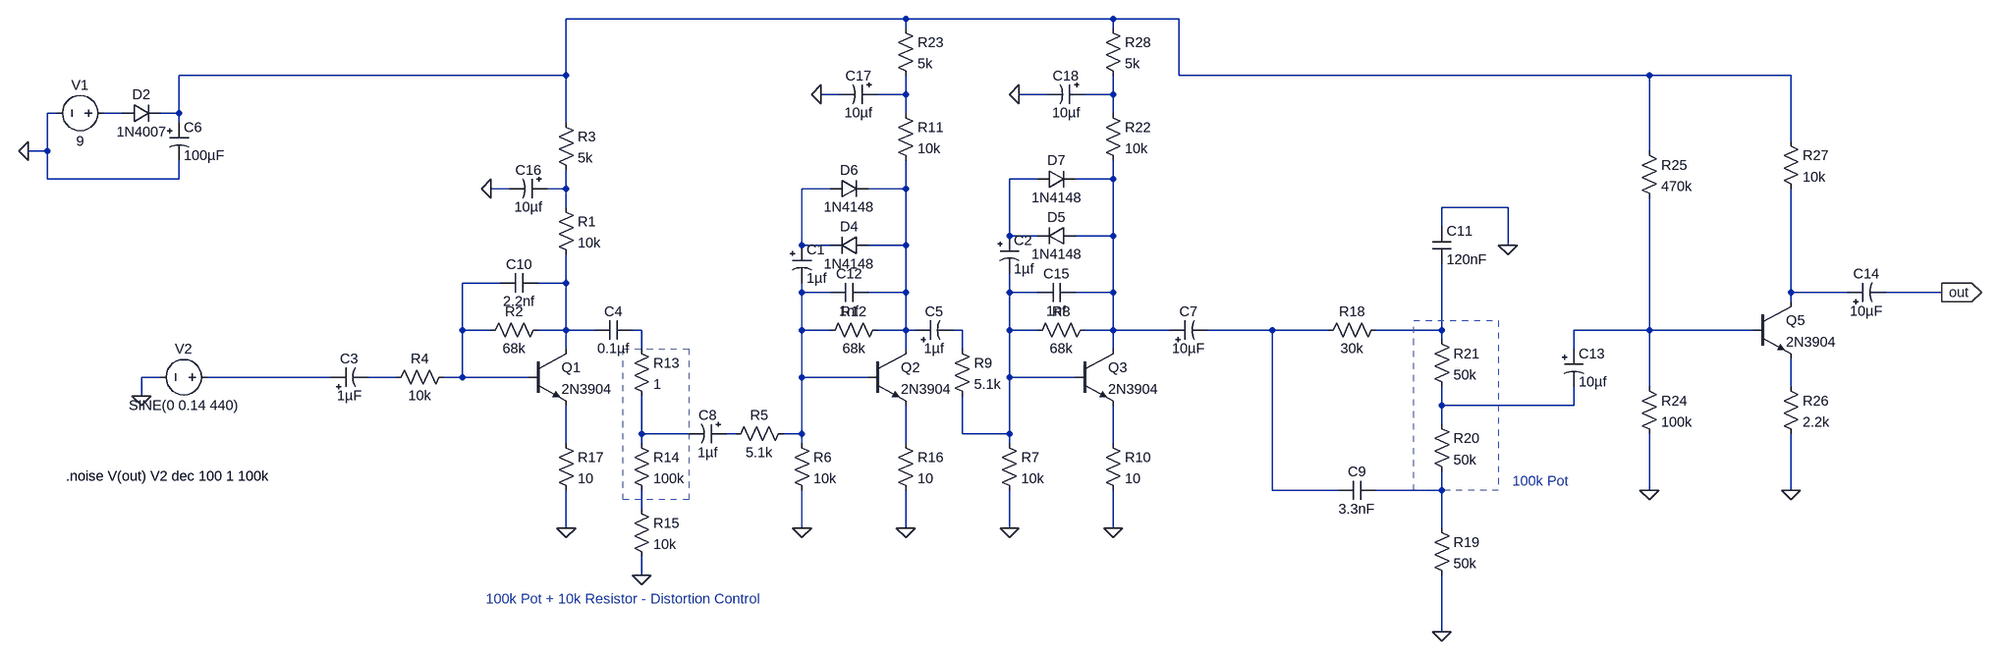
[diagram p0: schematic trantest_6_1.asc]
trantest_6_1.asc, the LTspice schematic file:
Version 4
SHEET 1 3536 1060
WIRE 1456 -432 880 -432
WIRE 1808 -432 1456 -432
WIRE 1920 -432 1808 -432
WIRE 1456 -416 1456 -432
WIRE 1808 -416 1808 -432
WIRE 880 -336 880 -432
WIRE 880 -336 -240 -336
WIRE 1920 -336 1920 -432
WIRE 2896 -336 1920 -336
WIRE 3168 -336 2896 -336
WIRE 1344 -304 1312 -304
WIRE 1456 -304 1456 -336
WIRE 1456 -304 1408 -304
WIRE 1696 -304 1648 -304
WIRE 1808 -304 1808 -336
WIRE 1808 -304 1760 -304
WIRE -448 -272 -464 -272
WIRE -336 -272 -368 -272
WIRE -240 -272 -240 -336
WIRE -240 -272 -272 -272
WIRE 1456 -272 1456 -304
WIRE 1808 -272 1808 -304
WIRE -240 -256 -240 -272
WIRE 880 -256 880 -336
WIRE 3168 -224 3168 -336
WIRE -464 -208 -464 -272
WIRE -464 -208 -496 -208
WIRE 2896 -208 2896 -336
WIRE -464 -160 -464 -208
WIRE -240 -160 -240 -192
WIRE -240 -160 -464 -160
WIRE 1680 -160 1632 -160
WIRE 1808 -160 1808 -192
WIRE 1808 -160 1744 -160
WIRE 784 -144 752 -144
WIRE 880 -144 880 -176
WIRE 880 -144 848 -144
WIRE 1328 -144 1280 -144
WIRE 1456 -144 1456 -192
WIRE 1456 -144 1392 -144
WIRE 880 -112 880 -144
WIRE 2656 -112 2544 -112
WIRE 2544 -80 2544 -112
WIRE 1632 -64 1632 -160
WIRE 1680 -64 1632 -64
WIRE 1808 -64 1808 -160
WIRE 1808 -64 1744 -64
WIRE 1280 -48 1280 -144
WIRE 1328 -48 1280 -48
WIRE 1456 -48 1456 -144
WIRE 1456 -48 1392 -48
WIRE 2656 -48 2656 -112
WIRE 768 16 704 16
WIRE 880 16 880 -32
WIRE 880 16 832 16
WIRE 1280 32 1280 16
WIRE 1328 32 1280 32
WIRE 1456 32 1456 -48
WIRE 1456 32 1392 32
WIRE 1632 32 1632 0
WIRE 1680 32 1632 32
WIRE 1808 32 1808 -64
WIRE 1808 32 1744 32
WIRE 3168 32 3168 -144
WIRE 3264 32 3168 32
WIRE 3424 32 3328 32
WIRE 3168 48 3168 32
WIRE 704 96 704 16
WIRE 752 96 704 96
WIRE 880 96 880 16
WIRE 880 96 832 96
WIRE 928 96 880 96
WIRE 1008 96 992 96
WIRE 1280 96 1280 32
WIRE 1328 96 1280 96
WIRE 1456 96 1456 32
WIRE 1456 96 1408 96
WIRE 1472 96 1456 96
WIRE 1552 96 1536 96
WIRE 1632 96 1632 32
WIRE 1680 96 1632 96
WIRE 1808 96 1808 32
WIRE 1808 96 1760 96
WIRE 1904 96 1808 96
WIRE 2256 96 1968 96
WIRE 2352 96 2256 96
WIRE 2544 96 2544 -16
WIRE 2544 96 2432 96
WIRE 2896 96 2896 -128
WIRE 2896 96 2768 96
WIRE 3104 96 2896 96
WIRE 2544 112 2544 96
WIRE 880 128 880 96
WIRE 1008 128 1008 96
WIRE 1456 128 1456 96
WIRE 1552 128 1552 96
WIRE 1808 128 1808 96
WIRE 2768 128 2768 96
WIRE -272 176 -304 176
WIRE 480 176 -192 176
WIRE 592 176 544 176
WIRE 704 176 704 96
WIRE 704 176 672 176
WIRE 816 176 704 176
WIRE 1280 176 1280 96
WIRE 1392 176 1280 176
WIRE 1632 176 1632 96
WIRE 1744 176 1632 176
WIRE 2896 192 2896 96
WIRE 3168 192 3168 144
WIRE -304 208 -304 176
WIRE 2544 224 2544 192
WIRE 2768 224 2768 192
WIRE 2768 224 2544 224
WIRE 2544 256 2544 224
WIRE 1008 272 1008 208
WIRE 1088 272 1008 272
WIRE 1168 272 1152 272
WIRE 1280 272 1280 176
WIRE 1280 272 1248 272
WIRE 1552 272 1552 208
WIRE 1632 272 1632 176
WIRE 1632 272 1552 272
WIRE 880 288 880 224
WIRE 1008 288 1008 272
WIRE 1280 288 1280 272
WIRE 1456 288 1456 224
WIRE 1632 288 1632 272
WIRE 1808 288 1808 224
WIRE 2256 368 2256 96
WIRE 2368 368 2256 368
WIRE 2544 368 2544 336
WIRE 2544 368 2432 368
WIRE 2896 368 2896 272
WIRE 3168 368 3168 272
WIRE 1008 400 1008 368
WIRE 880 432 880 368
WIRE 1280 432 1280 368
WIRE 1456 432 1456 368
WIRE 1632 432 1632 368
WIRE 1808 432 1808 368
WIRE 2544 432 2544 368
WIRE 1008 512 1008 480
WIRE 2544 608 2544 512
FLAG -496 -208 0
FLAG -304 208 0
FLAG 1008 512 0
FLAG 880 432 0
FLAG 1456 432 0
FLAG 1808 432 0
FLAG 2896 368 0
FLAG 3168 368 0
FLAG 2656 -48 0
FLAG 2544 608 0
FLAG 3424 32 out
IOPIN 3424 32 Out
FLAG 752 -144 0
FLAG 1312 -304 0
FLAG 1648 -304 0
FLAG 1280 432 0
FLAG 1632 432 0
SYMBOL npn 816 128 R0
SYMATTR InstName Q1
SYMATTR Value 2N3904
SYMBOL res 688 160 R90
WINDOW 0 0 56 VBottom 2
WINDOW 3 32 56 VTop 2
SYMATTR InstName R4
SYMATTR Value 10k
SYMBOL voltage -352 -272 R90
WINDOW 0 -32 56 VBottom 2
WINDOW 3 32 56 VTop 2
WINDOW 123 0 0 Left 0
WINDOW 39 0 0 Left 0
SYMATTR InstName V1
SYMATTR Value 9
SYMBOL diode -336 -256 R270
WINDOW 0 32 32 VTop 2
WINDOW 3 0 32 VBottom 2
SYMATTR InstName D2
SYMATTR Value 1N4007
SYMBOL polcap -256 -256 R0
SYMATTR InstName C6
SYMATTR Value 100µF
SYMBOL voltage -176 176 R90
WINDOW 0 -32 56 VBottom 2
WINDOW 3 32 56 VTop 2
WINDOW 123 0 0 Left 0
WINDOW 39 60 56 VTop 2
SYMATTR InstName V2
SYMATTR Value SINE(0 0.14 440)
SYMBOL res 848 80 R90
WINDOW 0 0 56 VBottom 2
WINDOW 3 32 56 VTop 2
SYMATTR InstName R2
SYMATTR Value 68k
SYMBOL npn 1392 128 R0
SYMATTR InstName Q2
SYMATTR Value 2N3904
SYMBOL res 1424 80 R90
WINDOW 0 0 56 VBottom 2
WINDOW 3 32 56 VTop 2
SYMATTR InstName R12
SYMATTR Value 68k
SYMBOL res 992 272 R0
SYMATTR InstName R14
SYMATTR Value 100k
SYMBOL res 992 384 R0
SYMATTR InstName R15
SYMATTR Value 10k
SYMBOL res 992 112 R0
SYMATTR InstName R13
SYMATTR Value 1
SYMBOL npn 1744 128 R0
SYMATTR InstName Q3
SYMATTR Value 2N3904
SYMBOL res 1776 80 R90
WINDOW 0 0 56 VBottom 2
WINDOW 3 32 56 VTop 2
SYMATTR InstName R8
SYMATTR Value 68k
SYMBOL res 1536 112 R0
SYMATTR InstName R9
SYMATTR Value 5.1k
SYMBOL res 1792 272 R0
SYMATTR InstName R10
SYMATTR Value 10
SYMBOL res 1440 272 R0
SYMATTR InstName R16
SYMATTR Value 10
SYMBOL res 864 272 R0
SYMATTR InstName R17
SYMATTR Value 10
SYMBOL polcap 480 192 R270
WINDOW 0 32 32 VTop 2
WINDOW 3 0 32 VBottom 2
SYMATTR InstName C3
SYMATTR Value 1µF
SYMBOL polcap 1472 112 R270
WINDOW 0 32 32 VTop 2
WINDOW 3 0 32 VBottom 2
SYMATTR InstName C5
SYMATTR Value 1µf
SYMBOL polcap 1904 112 R270
WINDOW 0 32 32 VTop 2
WINDOW 3 0 32 VBottom 2
SYMATTR InstName C7
SYMATTR Value 10µF
SYMBOL polcap 2752 128 R0
SYMATTR InstName C13
SYMATTR Value 10µf
SYMBOL res 2880 176 R0
SYMATTR InstName R24
SYMATTR Value 100k
SYMBOL npn 3104 48 R0
SYMATTR InstName Q5
SYMATTR Value 2N3904
SYMBOL res 3152 176 R0
SYMATTR InstName R26
SYMATTR Value 2.2k
SYMBOL polcap 3264 48 R270
WINDOW 0 32 32 VTop 2
WINDOW 3 0 32 VBottom 2
SYMATTR InstName C14
SYMATTR Value 10µF
SYMBOL res 2448 80 R90
WINDOW 0 0 56 VBottom 2
WINDOW 3 32 56 VTop 2
SYMATTR InstName R18
SYMATTR Value 30k
SYMBOL cap 2432 352 R90
WINDOW 0 0 32 VBottom 2
WINDOW 3 32 32 VTop 2
SYMATTR InstName C9
SYMATTR Value 3.3nF
SYMBOL res 2528 416 R0
SYMATTR InstName R19
SYMATTR Value 50k
SYMBOL res 2528 240 R0
SYMATTR InstName R20
SYMATTR Value 50k
SYMBOL res 2528 96 R0
SYMATTR InstName R21
SYMATTR Value 50k
SYMBOL cap 2528 -80 R0
SYMATTR InstName C11
SYMATTR Value 120nF
SYMBOL polcap 1152 256 R90
WINDOW 0 0 32 VBottom 2
WINDOW 3 32 32 VTop 2
SYMATTR InstName C8
SYMATTR Value 1µf
SYMBOL res 1264 256 R90
WINDOW 0 0 56 VBottom 2
WINDOW 3 32 56 VTop 2
SYMATTR InstName R5
SYMATTR Value 5.1k
SYMBOL diode 1744 -80 R90
WINDOW 0 0 32 VBottom 2
WINDOW 3 32 32 VTop 2
SYMATTR InstName D5
SYMATTR Value 1N4148
SYMBOL diode 1680 -144 R270
WINDOW 0 32 32 VTop 2
WINDOW 3 0 32 VBottom 2
SYMATTR InstName D7
SYMATTR Value 1N4148
SYMBOL res 864 -128 R0
SYMATTR InstName R1
SYMATTR Value 10k
SYMBOL res 864 -272 R0
SYMATTR InstName R3
SYMATTR Value 5k
SYMBOL polcap 848 -160 R90
WINDOW 0 0 32 VBottom 2
WINDOW 3 32 32 VTop 2
SYMATTR InstName C16
SYMATTR Value 10µf
SYMBOL res 1440 -288 R0
SYMATTR InstName R11
SYMATTR Value 10k
SYMBOL res 1792 -288 R0
SYMATTR InstName R22
SYMATTR Value 10k
SYMBOL res 1440 -432 R0
SYMATTR InstName R23
SYMATTR Value 5k
SYMBOL res 1792 -432 R0
SYMATTR InstName R28
SYMATTR Value 5k
SYMBOL polcap 1408 -320 R90
WINDOW 0 0 32 VBottom 2
WINDOW 3 32 32 VTop 2
SYMATTR InstName C17
SYMATTR Value 10µf
SYMBOL polcap 1760 -320 R90
WINDOW 0 0 32 VBottom 2
WINDOW 3 32 32 VTop 2
SYMATTR InstName C18
SYMATTR Value 10µf
SYMBOL res 2880 -224 R0
SYMATTR InstName R25
SYMATTR Value 470k
SYMBOL res 3152 -240 R0
SYMATTR InstName R27
SYMATTR Value 10k
SYMBOL polcap 1616 -64 R0
SYMATTR InstName C2
SYMATTR Value 1µf
SYMBOL cap 832 0 R90
WINDOW 0 0 32 VBottom 2
WINDOW 3 32 32 VTop 2
SYMATTR InstName C10
SYMATTR Value 2.2nf
SYMBOL res 1264 272 R0
SYMATTR InstName R6
SYMATTR Value 10k
SYMBOL res 1616 272 R0
SYMATTR InstName R7
SYMATTR Value 10k
SYMBOL diode 1392 -64 R90
WINDOW 0 0 32 VBottom 2
WINDOW 3 32 32 VTop 2
SYMATTR InstName D4
SYMATTR Value 1N4148
SYMBOL diode 1328 -128 R270
WINDOW 0 32 32 VTop 2
WINDOW 3 0 32 VBottom 2
SYMATTR InstName D6
SYMATTR Value 1N4148
SYMBOL polcap 1264 -48 R0
SYMATTR InstName C1
SYMATTR Value 1µf
SYMBOL cap 1392 16 R90
WINDOW 0 0 32 VBottom 2
WINDOW 3 32 32 VTop 2
SYMATTR InstName C12
SYMATTR Value 1nf
SYMBOL cap 1744 16 R90
WINDOW 0 0 32 VBottom 2
WINDOW 3 32 32 VTop 2
SYMATTR InstName C15
SYMATTR Value 1nf
SYMBOL cap 992 80 R90
WINDOW 0 0 32 VBottom 2
WINDOW 3 32 32 VTop 2
SYMATTR InstName C4
SYMATTR Value 0.1µf
TEXT 744 552 Left 2 ;100k Pot + 10k Resistor - Distortion Control
TEXT -432 344 Left 2 !.noise V(out) V2 dec 100 1 100k
TEXT 2664 352 Left 2 ;100k Pot
RECTANGLE Normal 1088 384 976 128 2
RECTANGLE Normal 2640 368 2496 80 2

The netlist it stands for:
* trantest_6_1.asc
Q1 N011 N010 N026 0 2N3904
R4 N010 N021 10k
V1 N004 0 9
D2 N004 N001 1N4007
C6 N001 0 100µF
V2 N020 0 SINE(0 0.14 440)
R2 N011 N010 68k
Q2 N009 N012 N027 0 2N3904
R12 N009 N012 68k
R14 N024 N030 100k
R15 N030 0 10k
R13 N015 N024 1
Q3 N006 N013 N028 0 2N3904
R8 N006 N013 68k
R9 N016 N013 5.1k
R10 N028 0 10
R16 N027 0 10
R17 N026 0 10
C3 N020 N021 1µF
C5 N009 N016 1µf
C7 N006 N017 10µF
C13 N019 N023 10µf
R24 N019 0 100k
Q5 N014 N019 N022 0 2N3904
R26 N022 0 2.2k
C14 N014 out 10µF
R18 N018 N017 30k
C9 N029 N017 3.3nF
R19 N029 0 50k
R20 N023 N029 50k
R21 N018 N023 50k
C11 0 N018 120nF
C8 N025 N024 1µf
R5 N012 N025 5.1k
D5 N006 N005 1N4148
D7 N005 N006 1N4148
R1 N007 N011 10k
R3 N001 N007 5k
C16 N007 0 10µf
R11 N002 N009 10k
R22 N003 N006 10k
R23 N001 N002 5k
R28 N001 N003 5k
C17 N002 0 10µf
C18 N003 0 10µf
R25 N001 N019 470k
R27 N001 N014 10k
C2 N005 N013 1µf
C10 N011 N010 2.2nf
R6 N012 0 10k
R7 N013 0 10k
D4 N009 N008 1N4148
D6 N008 N009 1N4148
C1 N008 N012 1µf
C12 N009 N012 1nf
C15 N006 N013 1nf
C4 N015 N011 0.1µf
.model D D
.lib standard.dio
.model NPN NPN
.model PNP PNP
.lib standard.bjt
* 100k Pot + 10k Resistor - Distortion Control
.noise V(out) V2 dec 100 1 100k
* 100k Pot
.backanno
.end